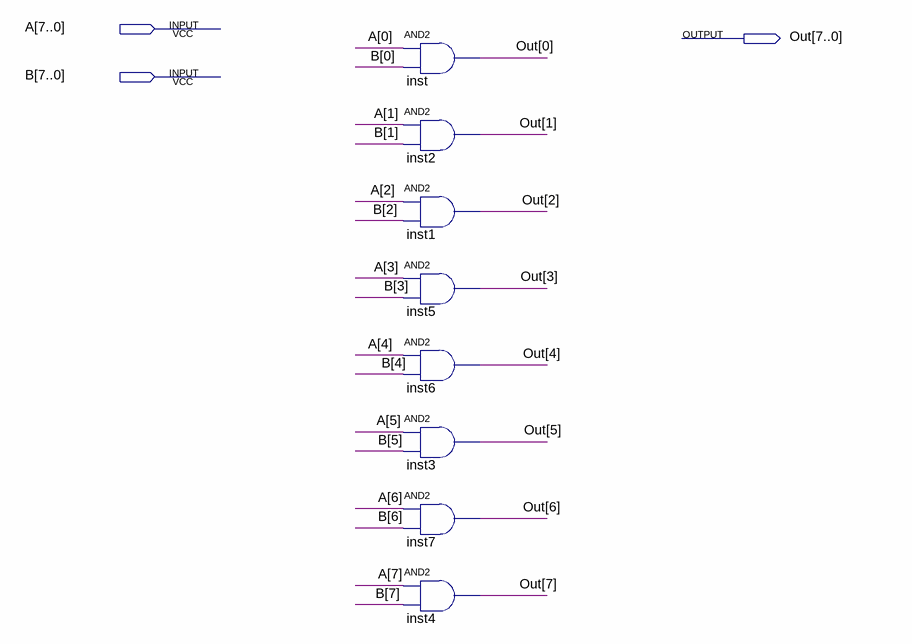
[diagram p0: schematic sheet]
// Quartus schematic And_8bits.bdf as structural Verilog: 8 symbols, 3 pins
module And_8bits (
  input  [7:0] A,
  input  [7:0] B,
  output [7:0] Out
);

  and inst (Out[0], A[0], B[0]);
  and inst2 (Out[1], A[1], B[1]);
  and inst1 (Out[2], A[2], B[2]);
  and inst5 (Out[3], A[3], B[3]);
  and inst6 (Out[4], A[4], B[4]);
  and inst3 (Out[5], A[5], B[5]);
  and inst7 (Out[6], A[6], B[6]);
  and inst4 (Out[7], A[7], B[7]);
endmodule
